# Altium schematic sheet VCLPF.SchDoc
size A4
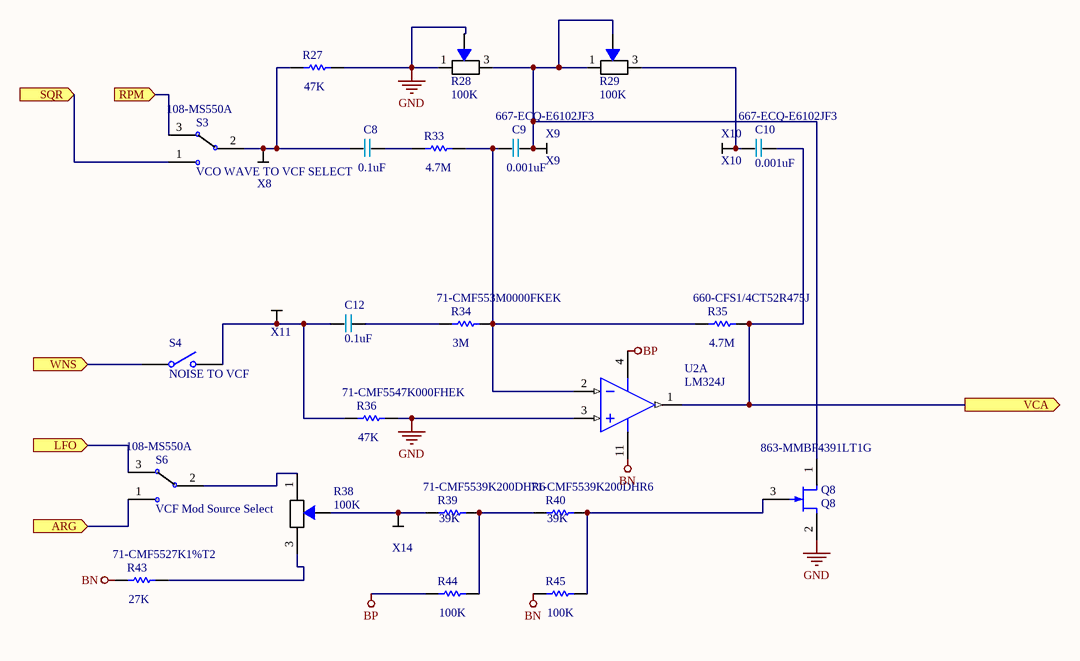
[diagram p0: VCLPF.SchDoc]

## Parts
C8  0.1uF  [Cap Film 5]
C9  Supplier Part Number 1: 667-ECQ-E6102JF3  [Cap Film 5]  (hidden comment: 0.001uF)
C10  Supplier Part Number 1: 667-ECQ-E6102JF3  [Cap Film 5]  (hidden comment: 0.001uF)
C12  0.1uF  [Cap Film 5]
Q8  Q8  Supplier Part Number 2: 863-MMBF4391LT1G  [ONSC-SOT-23-3-318-08_V]
R27  47K  [AXIAL-0.3]
R28  100K  [Potentiometer]
R29  100K  [Potentiometer]
R33  4.7M  [AXIAL-0.3]
R34  Supplier Part Number 1: 71-CMF553M0000FKEK  [AXIAL-0.3]  (hidden comment: 3M)
R35  Supplier Part Number 1: 660-CFS1/4CT52R475J  [AXIAL-0.3]  (hidden comment: 4.7M)
R36  Supplier Part Number 1: 71-CMF5547K000FHEK  [AXIAL-0.3]  (hidden comment: 47K)
R38  100K  [Potentiometer]
R39  Supplier Part Number 1: 71-CMF5539K200DHR6  [AXIAL-0.3]  (hidden comment: 39K)
R40  Supplier Part Number 1: 71-CMF5539K200DHR6  [AXIAL-0.3]  (hidden comment: 39K)
R43  Supplier Part Number 1: 71-CMF5527K1%T2  [AXIAL-0.3]  (hidden comment: 27K)
R44  100K  [AXIAL-0.3]
R45  100K  [AXIAL-0.3]
S3  VCO WAVE TO VCF SELECT  Supplier Part Number 1: 108-MS550A  [SPDT Switch]
S4  NOISE TO VCF  [SPST-2]
S6  VCF Mod Source Select  Supplier Part Number 1: 108-MS550A  [SPDT Switch]
U2  LM324J  [J14A]  (part A of 4)
X8  Pad  [Pad]  (value not drawn)
X9  X9  [Pad]
X10  X10  [Pad]
X11  X11  [Pad]  (value not drawn)
X14  X14  [Pad]  (value not drawn)

## Ports
ARG (in), LFO (in), RPM (in), SQR (in), VCA (out), WNS (in)

## Nets
BN: R43.1 R45.1 U2.11(GND)
BP: R44.1 U2.4(V+)
GND: Q8.2(S) R27.2 R28.1 R28.2 R36.2 U2.3(IN1+)
ARG: S6.1 ; port ARG
LFO: S6.3 ; port LFO
RPM: S3.3 ; port RPM
SQR: S3.1 ; port SQR
VCA: C10.2 R35.2 U2.1(OUT1) ; port VCA
WNS: S4.1(COMMON) ; port WNS
NetC8_1: C8.1 R27.1 S3.2 X8.1
NetC8_2: C8.2 R33.1
NetC9_1: C9.1 R33.2 R34.2 R35.1 U2.2(IN1-)
NetC9_2: C9.2 Q8.1(D) R28.3 R29.1 R29.2 X9.1
NetC10_1: C10.1 R29.3 X10.1
NetC12_1: C12.1 R36.1 S4.2(NO) X11.1
NetC12_2: C12.2 R34.1
NetQ8_3: Q8.3(G) R40.2 R45.2
NetR38_1: R38.1 S6.2
NetR38_2: R38.2 R39.1 X14.1
NetR38_3: R38.3 R43.2
NetR39_2: R39.2 R40.1 R44.2

## Library data of the parts
C8 C12 = Cap Film 5: Value: 0.1uF; Supplier 1: Mouser; Supplier Part Number 1: 594-K104K20X7RH53K2
C9 = Cap Film 5: Manufacturer: Panasonic; Manufacturer Part Number: ECQ-E4103KF; Capacitance: 0.01 uF; Tolerance: 5 %; Type: Metallized Polyester Film Capacitor; Voltage Rating DC: 400 VDC; Capacitance - nF: 10 nF; Capacitance - pF: 10000 pF; Dielectric: Polyester; Lead Diameter: 0.6 mm; Value: 0.001uF; Supplier 1: Mouser; RoHS: RoHS Compliant; Category: Film Capacitors; Stock 1: 175429; Pricing 1: 1=0.360, 10=0.173, 100=0.123, 500=0.111, 1000=0.093, 2000=0.088, 10000=0.077, 25000=0.074, 50000=0.066 (USD); Height: 7.4 mm; Length: 10.3 mm; Packaging: Bulk; Product: General Film Capacitors; Series: ECQE(B); Termination Style: Radial; Width: 4.3 mm; Brand: Panasonic; Lead Spacing: 7.5 mm; Maximum Operating Temperature: + 105 C; Minimum Operating Temperature: - 40 C; Standard Pack Qty: 1000; RoHS - Mouser: Y; Minimum Order Quantity: 1; Reeling: False; ComponentLink1URL: http://www.mouser.com/ds/2/315/ABD0000C179-947645.pdf; ComponentLink1Description: http://www.mouser.com/ds/2/315/ABD0000C179-947645.pdf
C10 = Cap Film 5: Manufacturer: Panasonic; Manufacturer Part Number: ECQ-E6102JF3; Capacitance: 1000 pF; Tolerance: 5 %; Type: Metallized Polyester Film Capacitor; Voltage Rating DC: 630 VDC; Capacitance - nF: 1 nF; Dielectric: Polyester; Lead Diameter: 0.6 mm; Value: 0.001uF; Supplier 1: Mouser; RoHS: RoHS Compliant; Category: Film Capacitors; Stock 1: 1487; Pricing 1: 1=0.500, 10=0.244, 100=0.174, 500=0.157, 1000=0.132, 2000=0.118, 10000=0.108, 25000=0.105, 50000=0.093 (USD); Length: 10 mm; Product: General Film Capacitors; Series: ECQE(B); Termination Style: Radial; Width: 4.5 mm; Brand: Panasonic; Number of Pins: 2; Capacitance - uF: 0.001 uF; Lead Spacing: 5 mm; Maximum Operating Temperature: + 105 C; Minimum Operating Temperature: - 40 C; Standard Pack Qty: 1000; RoHS - Mouser: Y; Minimum Order Quantity: 1; Reeling: False; ComponentLink1URL: http://www.mouser.com/ds/2/315/ABD0000C179-947645.pdf; ComponentLink1Description: http://www.mouser.com/ds/2/315/ABD0000C179-947645.pdf
Q8 = MMBF4391LT1: JFET Switching Transistor, N-Channel, 3-Pin SOT-23, Tape and Reel; Manufacturer: On Semiconductor; Manufacturer Part Number: MMBF4391LT1G; Channel Polarity: N Channel; Ciss Max (pF): 14; Crss Max (pF): 3.5; IDSS Max (uA): 150000; IDSS Min (uA): 50000; V(BR)GSS Min (V): 30; Configuration: Single; Drain-Source Current at Vgs=0: 50 mA to 150 mA; Vds - Drain-Source Breakdown Voltage: 30 V; DatasheetVersion: Rev. 10; PackageVersion: Rev. AP, 11/2009; PackageReference: SOT-23-3-318-08; PackageDescription: 3-Pin Small Outline Transistor, Body 2.92 x 1.3 mm, Pitch 0.95 mm; Supplier 1: Mouser; Supplier Part Number 1: 863-MMBF4391LT1G; Packing: Tape and Reel; Mounting Technology: Surface Mount; PartNumber: MMBF4391LT1; ComponentLink1Description: Manufacturer URL; ComponentLink1URL: http://www.onsemi.com/; ComponentLink2Description: Datasheet; ComponentLink2URL: http://www.onsemi.com/pub_link/Collateral/MMBF4391LT1-D.PDF; ComponentLink3Description: Package Specification; ComponentLink3URL: http://www.onsemi.cn/pub_link/Collateral/318-08.PDF; Supplier 2: Mouser; RoHS: RoHS Compliant; Category: JFET; Stock 2: 3330; Pricing 2: 1=0.490, 10=0.339, 100=0.156, 1000=0.120, 3000=0.102, 9000=0.093, 24000=0.087, 45000=0.078, 99000=0.075 (USD); Package / Case: SOT-23-3; Packaging: Reel; Series: MMBF4391L; Brand: ON Semiconductor; Mounting Style: SMD/SMT; Transistor Polarity: N-Channel; Standard Pack Qty: 3000; Vgs - Gate-Source Breakdown Voltage: 30 V; RoHS - Mouser: Y; Minimum Order Quantity: 1; Reeling: True; ComponentLink4URL: http://www.mouser.com/ds/2/308/MMBF4391LT1-D-108578.pdf; ComponentLink4Description: http://www.mouser.com/ds/2/308/MMBF4391LT1-D-108578.pdf
R27 = Res1: Resistor; Manufacturer Part Number: CMF5547K000FHEK; Lead Diameter: 0.64 mm; Published: 8-Jun-2000; LatestRevisionDate: 17-Jul-2002; LatestRevisionNote: Re-released for DXP Platform.; PackageReference: AXIAL-0.3; Publisher: Altium Limited; PackageDescription: Axial Device, Thru-Hole; 2 Leads; 0.3 in Pin Spacing; Value: 47K; Category: Metal Film Resistors - Through Hole; ComponentLink1Description: http://www.mouser.com/ds/2/427/cmfind-239942.pdf; ComponentLink1URL: http://www.mouser.com/ds/2/427/cmfind-239942.pdf; Diameter: 2.29 mm; Supplier 1: Mouser; Supplier Part Number 1: 71-CMF5547K000FHEK
R28 R29 R38 = Potentiometer: My Own; Manufacturer Part Number: RV09AF-40-20K-B100K; Brand: Alpha (Taiwan); Number of Gangs: 1 Gang; Number of Turns: 1 Turn; Power Rating: 100 mW; Resistance: 100 kOhms; Shaft Diameter: 6 mm; Shaft Length: 20 mm; Shaft Type: Knurled / Serrated; Tolerance: 20 %; Voltage Rating: 50 V; Value: 100K; Category: Potentiometers; Manufacturer: Alpha (Taiwan); Minimum Order Quantity: 1; Mounting Style: Panel Mount; Operating Temperature Range: - 10 C to + 70 C; Pricing 1: 1=1.32, 25=1.11, 50=1.03, 100=0.940, 500=0.790, 1000=0.660, 2500=0.550, 5000=0.500, 10000=0.450 (USD); Product: Potentiometer; Reeling: False; RoHS - Mouser: Y; RoHS: RoHS Compliant; Standard Pack Qty: 1000; Stock 1: 13035; Supplier 1: Mouser; Supplier Part Number 1: 317-2090F-100K; Taper: Linear; Termination Style: Through Hole; Type: Rotary
R33 = Res1: Resistor; Published: 8-Jun-2000; LatestRevisionDate: 17-Jul-2002; LatestRevisionNote: Re-released for DXP Platform.; PackageReference: AXIAL-0.3; Publisher: Altium Limited; PackageDescription: Axial Device, Thru-Hole; 2 Leads; 0.3 in Pin Spacing; Value: 4.7M; Supplier 1: Mouser; Supplier Part Number 1: 660-CFS1/4CT52R475J
R34 = Res1: Resistor; Manufacturer: Vishay / Dale; Manufacturer Part Number: CMF553M0000FKEK; Power Rating: 500 mW (1/2 W); Resistance: 3 MOhms; Temperature Coefficient: 100 PPM / C; Tolerance: 1 %; Voltage Rating: 250 V; Lead Diameter: 0.64 mm; Published: 8-Jun-2000; LatestRevisionDate: 17-Jul-2002; LatestRevisionNote: Re-released for DXP Platform.; PackageReference: AXIAL-0.3; Publisher: Altium Limited; PackageDescription: Axial Device, Thru-Hole; 2 Leads; 0.3 in Pin Spacing; Value: 3M; Supplier 1: Mouser; RoHS: RoHS Compliant; Category: Metal Film Resistors - Through Hole; Stock 1: 575; Pricing 1: 1=0.510, 50=0.503, 100=0.493, 500=0.481, 1000=0.418, 2000=0.405, 5000=0.393, 10000=0.381, 25000=0.380 (USD); Diameter: 2.29 mm; Length: 6.1 mm; Operating Temperature Range: - 55 C to + 175 C; Packaging: Bulk; Product: Metal Film Resistors Controlled Temp Coefficient; Series: CMF Industrial; Termination Style: Axial; Type: Metal Film Resistors, Industrial, Precision; Brand: Vishay / Dale; Standard Pack Qty: 100; RoHS - Mouser: Y; Minimum Order Quantity: 1; Reeling: False; ComponentLink1URL: http://www.mouser.com/ds/2/427/cmfind-239942.pdf; ComponentLink1Description: http://www.mouser.com/ds/2/427/cmfind-239942.pdf
R35 = Res1: Resistor; Manufacturer: KOA Speer; Manufacturer Part Number: CFS1/4CT52R475J; Power Rating: 250 mW (1/4 W); Resistance: 4.7 MOhms; Tolerance: 5 %; Voltage Rating: 250 V; Qualification: AEC-Q200; Published: 8-Jun-2000; LatestRevisionDate: 17-Jul-2002; LatestRevisionNote: Re-released for DXP Platform.; PackageReference: AXIAL-0.3; Publisher: Altium Limited; PackageDescription: Axial Device, Thru-Hole; 2 Leads; 0.3 in Pin Spacing; Value: 4.7M; Supplier 1: Mouser; RoHS: RoHS Compliant; Category: Carbon Film Resistors - Through Hole; Stock 1: 14824; Pricing 1: 1=0.150, 5000=0.030, 10000=0.018, 50000=0.014, 100000=0.010 (USD); Diameter: 1.7 mm; Length: 3.2 mm; Operating Temperature Range: - 55 C to + 155 C; Packaging: Reel; Series: CF; Termination Style: Axial; Type: Carbon Film Leaded Resistor; Brand: KOA Speer; Standard Pack Qty: 5000; RoHS - Mouser: Y; Minimum Order Quantity: 1; Reeling: True; ComponentLink1URL: http://www.mouser.com/ds/2/219/CF-6922.pdf; ComponentLink1Description: http://www.mouser.com/ds/2/219/CF-6922.pdf
R36 = Res1: Resistor; Manufacturer: Vishay / Dale; Manufacturer Part Number: CMF5547K000FHEK; Power Rating: 500 mW (1/2 W); Resistance: 47 kOhms; Temperature Coefficient: 50 PPM / C; Tolerance: 1 %; Voltage Rating: 250 V; Lead Diameter: 0.64 mm; Published: 8-Jun-2000; LatestRevisionDate: 17-Jul-2002; LatestRevisionNote: Re-released for DXP Platform.; PackageReference: AXIAL-0.3; Publisher: Altium Limited; PackageDescription: Axial Device, Thru-Hole; 2 Leads; 0.3 in Pin Spacing; Value: 47K; Supplier 1: Mouser; RoHS: RoHS Compliant; Category: Metal Film Resistors - Through Hole; Stock 1: 569; Pricing 1: 1=0.420, 25=0.242, 100=0.152, 500=0.131, 1000=0.100, 2000=0.093, 5000=0.084 (USD); Diameter: 2.29 mm; Length: 6.1 mm; Operating Temperature Range: - 55 C to + 175 C; Packaging: Bulk; Product: Metal Film Resistors Controlled Temp Coefficient; Series: CMF Industrial; Termination Style: Axial; Type: Metal Film Resistors, Industrial, Precision; Brand: Vishay / Dale; Standard Pack Qty: 100; RoHS - Mouser: Y; Minimum Order Quantity: 1; Reeling: False; ComponentLink1URL: http://www.mouser.com/ds/2/427/cmfind-239942.pdf; ComponentLink1Description: http://www.mouser.com/ds/2/427/cmfind-239942.pdf
R39 R40 = Res1: Resistor; Manufacturer: Vishay / Dale; Manufacturer Part Number: CMF5539K200DHR6; Power Rating: 500 mW (1/2 W); Resistance: 39.2 kOhms; Temperature Coefficient: 50 PPM / C; Tolerance: 0.5 %; Voltage Rating: 250 V; Published: 8-Jun-2000; LatestRevisionDate: 17-Jul-2002; LatestRevisionNote: Re-released for DXP Platform.; PackageReference: AXIAL-0.3; Publisher: Altium Limited; PackageDescription: Axial Device, Thru-Hole; 2 Leads; 0.3 in Pin Spacing; Value: 39K; Supplier 1: Mouser; RoHS: No; Category: Metal Film Resistors - Through Hole; Stock 1: 502; Pricing 1: 1=0.230, 50=0.225, 100=0.220, 500=0.193, 1000=0.181, 4000=0.171, 8000=0.160, 12000=0.146, 20000=0.135 (USD); Diameter: 2.29 mm; Length: 6.1 mm; Operating Temperature Range: - 55 C to + 175 C; Packaging: Reel; Product: Metal Film Resistors Controlled Temp Coefficient; Series: CMF Industrial; Termination Style: Axial; Type: Metal Film Resistors, Industrial, Precision; Brand: Vishay / Dale; Standard Pack Qty: 1000; RoHS - Mouser: N; Minimum Order Quantity: 1; Reeling: True; ComponentLink1URL: http://www.mouser.com/ds/2/427/cmfind-239942.pdf; ComponentLink1Description: http://www.mouser.com/ds/2/427/cmfind-239942.pdf
R43 = Res1: Resistor; Manufacturer: Vishay / Dale; Manufacturer Part Number: CMF5527K000FHBF; Power Rating: 500 mW (1/2 W); Resistance: 27 kOhms; Temperature Coefficient: 50 PPM / C; Tolerance: 1 %; Voltage Rating: 250 V; Lead Diameter: 0.64 mm; Published: 8-Jun-2000; LatestRevisionDate: 17-Jul-2002; LatestRevisionNote: Re-released for DXP Platform.; PackageReference: AXIAL-0.3; Publisher: Altium Limited; PackageDescription: Axial Device, Thru-Hole; 2 Leads; 0.3 in Pin Spacing; Value: 27K; Supplier 1: Mouser; RoHS: No; Category: Metal Film Resistors - Through Hole; Stock 1: 827; Pricing 1: 1=0.230, 100=0.179, 300=0.168, 500=0.158, 1000=0.120, 2000=0.110, 11000=0.090, 23000=0.080 (USD); Diameter: 2.29 mm; Length: 6.1 mm; Operating Temperature Range: - 55 C to + 175 C; Packaging: Bulk; Product: Metal Film Resistors Controlled Temp Coefficient; Series: CMF Industrial; Termination Style: Axial; Type: Metal Film Resistors, Industrial, Precision; Brand: Vishay / Dale; Standard Pack Qty: 100; RoHS - Mouser: N; Minimum Order Quantity: 1; Reeling: False; ComponentLink1URL: http://www.mouser.com/ds/2/427/cmfind-239942.pdf; ComponentLink1Description: http://www.mouser.com/ds/2/427/cmfind-239942.pdf
R44 R45 = Res1: Resistor; Manufacturer Part Number: CMF55100K00FHEK; Brand: Vishay / Dale; Lead Diameter: 0.64 mm; Power Rating: 500 mW (1/2 W); Resistance: 100 kOhms; Temperature Coefficient: 50 PPM / C; Tolerance: 1 %; Voltage Rating: 250 V; Published: 8-Jun-2000; LatestRevisionDate: 17-Jul-2002; LatestRevisionNote: Re-released for DXP Platform.; PackageReference: AXIAL-0.3; Publisher: Altium Limited; PackageDescription: Axial Device, Thru-Hole; 2 Leads; 0.3 in Pin Spacing; Value: 100K; Category: Metal Film Resistors - Through Hole; ComponentLink1Description: http://www.mouser.com/ds/2/427/cmfind-239942.pdf; ComponentLink1URL: http://www.mouser.com/ds/2/427/cmfind-239942.pdf; Diameter: 2.29 mm; Length: 6.1 mm; Manufacturer: Vishay / Dale; Minimum Order Quantity: 1; Operating Temperature Range: - 55 C to + 175 C; Packaging: Bulk; Pricing 1: 1=0.230, 25=0.181, 100=0.132, 500=0.115, 1000=0.099, 2000=0.092, 5000=0.087, 10000=0.082, 25000=0.072 (USD); Product: Metal Film Resistors Controlled Temp Coefficient; Reeling: False; RoHS - Mouser: Y; RoHS: RoHS Compliant; Series: CMF Industrial; Standard Pack Qty: 100; Stock 1: 4041; Supplier 1: Mouser; Supplier Part Number 1: 71-CMF55100K00FHEK; Termination Style: Axial; Type: Metal Film Resistors, Industrial, Precision; Supplier Part Number 2: 71-CMF55100K00BEEB
S3 S6 = SPDT Switch: Manufacturer: Mountain Switch; Actuator: Paddle; Bushing Size: M6; Switch Function: ON - ON; Voltage Rating AC: 125 VAC; Product Status: Not Recommended for New Designs; Supplier 1: Mouser; Manufacturer Part Number: 108-MS550A; RoHS: No; Category: Toggle Switches; Stock 1: 531; Pricing 1: 1=2.15, 50=2.09, 100=2.03, 500=1.97, 1000=1.80, 2000=1.71, 5000=1.63 (USD); Contact Form: SPDT; Contact Plating: Gold; Mounting Type: Bushing; Packaging: Bulk; Series: 108; Terminal Seal: Sealed; Termination Style: Solder Lug; Type: Toggle Switches; Brand: Mountain Switch; Contact Material: Nickel; Mounting Style: Panel; Standard Pack Qty: 100; RoHS - Mouser: N; Minimum Order Quantity: 1; Reeling: False; ComponentLink1URL: http://www.mouser.com/ds/2/221/MS-200272-200731.pdf; ComponentLink1Description: http://www.mouser.com/ds/2/221/MS-200272-200731.pdf
S4 = SW-SPST: Single-Pole, Single-Throw Switch; Published: 24-Mar-1999; LatestRevisionDate: 17-Jul-2002; LatestRevisionNote: Re-released for DXP Platform.; PackageReference: SPST-2; Publisher: Altium Limited; PackageDescription: Switch; 2 Leads; Supplier 1: Mouser; Supplier Part Number 1: 108-MS550K
U2 = LM324J: Low Power Quad Operational Amplifier, 14-pin CerDIP; Manufacturer: National Semiconductor; PackageTopMarking: NSUZXYYTT*LM324J; PowerWise: N; CompType: Amplifiers; High-Reliability: Y; DatasheetVersion: Aug-2000; PackageVersion: revJ, Jul-2002; PackageReference: J14A; PackageDescription: Cerdip, .400 x .310in Body, 14 Lead, .300in Centers, .100in Pitch; PartNumber: LM324J; RoHS: N; PinCount: 14; ComponentLink1Description: Manufacturer URL; ComponentLink1URL: http://www.national.com/; ComponentLink2Description: LM324 Datasheet; ComponentLink2URL: http://www.national.com/ds/LM/LM324.pdf; ComponentLink3Description: LM324 Web Page; ComponentLink3URL: http://www.national.com/pf/LM/LM324.html; ComponentLink4Description: J14A Package Page; ComponentLink4URL: http://www.national.com/packaging/folders/j14a.html; Supplier 1: Mouser; Supplier Part Number 1: 512-LM324N
X9-X11 X14 = Pad